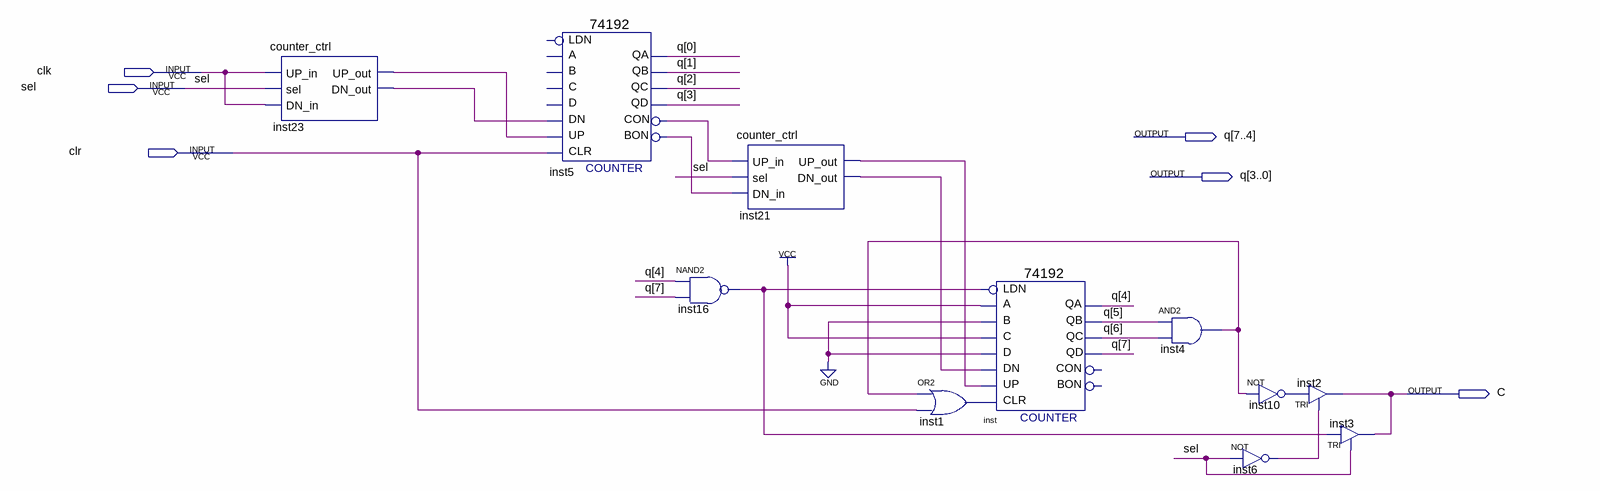
[diagram p0: schematic sheet]
// Quartus schematic counter_60_192.bdf as structural Verilog: 11 symbols, 6 pins
module counter_60_192 (
  input  clk,
  input  sel,
  input  clr,
  output [7:0] q,
  output C
);

  wire inst1_out, inst4_out, inst5_bon, inst5_con, inst6_out, inst10_out, inst16_out, inst21_dn_out,
       inst21_up_out, inst23_dn_out, inst23_up_out;

  counter_ctrl inst23 (.UP_in(clk), .sel(sel), .DN_in(clk), .UP_out(inst23_up_out), .DN_out(inst23_dn_out));
  \74192  inst5 (
    .CLR(clr), .UP(inst23_up_out), .DN(inst23_dn_out), .QB(q[1]), .BON(inst5_bon), .CON(inst5_con),
    .QA(q[0]), .QC(q[2]), .QD(q[3]));  // open: D, C, A, B, LDN
  nand inst16 (inst16_out, q[4], q[7]);
  counter_ctrl inst21 (.UP_in(inst5_con), .sel(sel), .DN_in(inst5_bon), .UP_out(inst21_up_out), .DN_out(inst21_dn_out));
  or inst1 (inst1_out, inst4_out, clr);
  \74192  inst (
    .D(1'b0), .C(1'b1), .A(1'b1), .B(1'b0), .CLR(inst1_out), .UP(inst21_up_out), .DN(inst21_dn_out),
    .LDN(inst16_out), .QB(q[5]), .QA(q[4]), .QC(q[6]), .QD(q[7]));  // open: BON, CON
  and inst4 (inst4_out, q[5], q[6]);
  not inst6 (inst6_out, sel);
  TRI inst2 (.IN(inst10_out), .OE(inst6_out), .OUT(C));
  not inst10 (inst10_out, inst4_out);
  TRI inst3 (.IN(inst16_out), .OE(sel), .OUT(C));
endmodule
